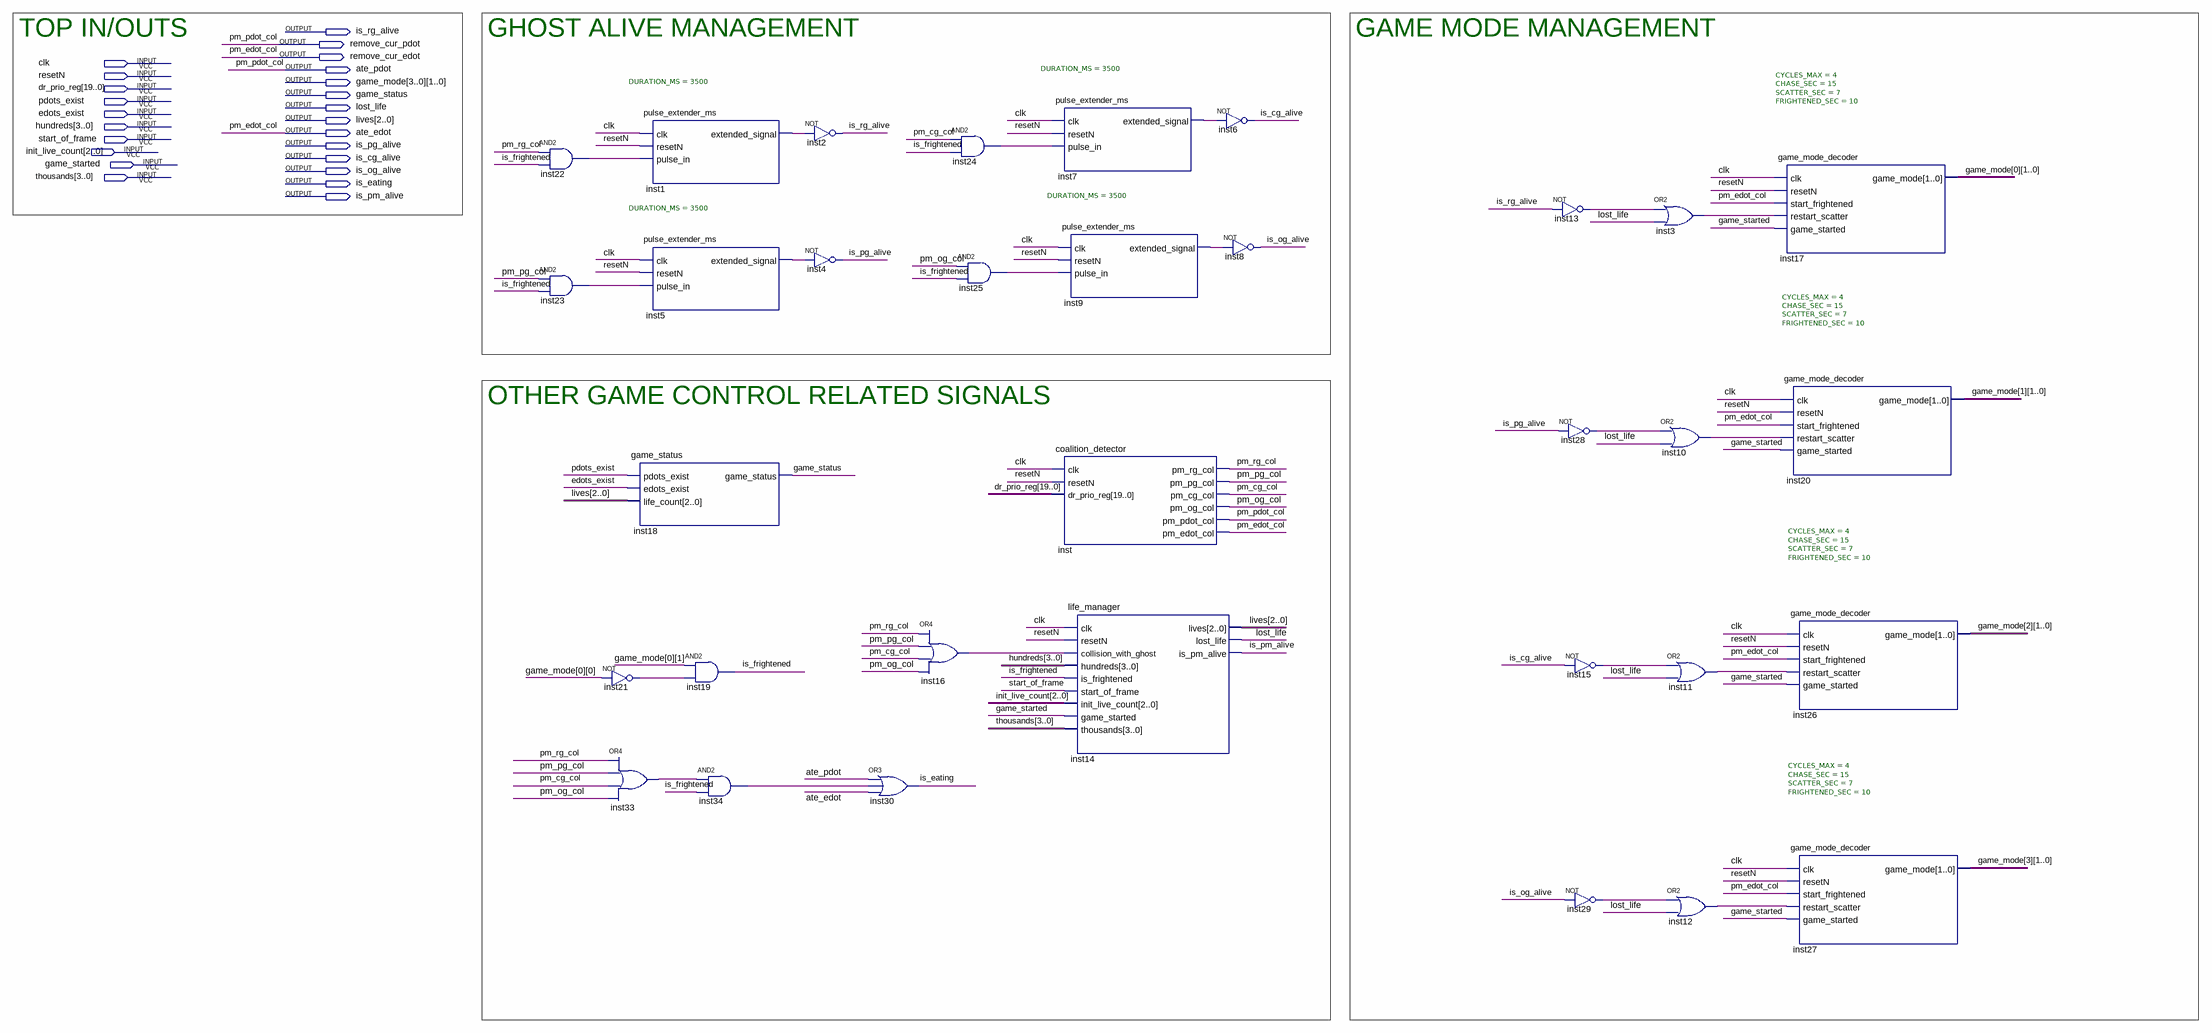
[diagram p0: schematic sheet]
// Quartus schematic TOP_GAME_CONTROL.bdf as structural Verilog: 33 symbols, 24 pins
module TOP_GAME_CONTROL (
  input  clk,
  input  resetN,
  input  [19:0] dr_prio_reg,
  input  pdots_exist,
  input  edots_exist,
  input  [3:0] hundreds,
  input  start_of_frame,
  input  [2:0] init_live_count,
  input  game_started,
  input  [3:0] thousands,
  output is_rg_alive,
  output remove_cur_pdot,
  output remove_cur_edot,
  output ate_pdot,
  output [1:0] game_mode_3,
  output [1:0] game_mode_2,
  output [1:0] game_mode_1,
  output [1:0] game_mode_0,
  output game_status,
  output lost_life,
  output [2:0] lives,
  output ate_edot,
  output is_pg_alive,
  output is_cg_alive,
  output is_og_alive,
  output is_eating,
  output is_pm_alive
);

  wire inst1_extended_signal, inst3_out, inst5_extended_signal, inst7_extended_signal, inst9_extended_signal,
       inst10_out, inst11_out, inst12_out, inst13_out, inst15_out, inst16_out, inst21_out, inst22_out,
       inst23_out, inst24_out, inst25_out, inst28_out, inst29_out, inst33_out, inst34_out, is_frightened,
       pm_cg_col, pm_og_col, pm_pg_col, pm_rg_col;

  and inst22 (inst22_out, pm_rg_col, is_frightened);
  and inst23 (inst23_out, pm_pg_col, is_frightened);
  not inst21 (inst21_out, game_mode_0[0]);
  or inst33 (inst33_out, pm_rg_col, pm_pg_col, pm_cg_col, pm_og_col);
  pulse_extender_ms #(.DURATION_MS(3500)) inst1 (
    .clk(clk), .resetN(resetN), .pulse_in(inst22_out), .extended_signal(inst1_extended_signal));
  pulse_extender_ms #(.DURATION_MS(3500)) inst5 (
    .clk(clk), .resetN(resetN), .pulse_in(inst23_out), .extended_signal(inst5_extended_signal));
  game_status inst18 (
    .pdots_exist(pdots_exist), .edots_exist(edots_exist), .life_count(lives), .game_status(game_status));
  and inst19 (is_frightened, game_mode_0[1], inst21_out);
  and inst34 (inst34_out, inst33_out, is_frightened);
  not inst2 (is_rg_alive, inst1_extended_signal);
  not inst4 (is_pg_alive, inst5_extended_signal);
  or inst30 (is_eating, ate_pdot, inst34_out, ate_edot);
  and inst24 (inst24_out, pm_cg_col, is_frightened);
  and inst25 (inst25_out, pm_og_col, is_frightened);
  or inst16 (inst16_out, pm_rg_col, pm_pg_col, pm_cg_col, pm_og_col);
  pulse_extender_ms #(.DURATION_MS(3500)) inst7 (
    .clk(clk), .resetN(resetN), .pulse_in(inst24_out), .extended_signal(inst7_extended_signal));
  pulse_extender_ms #(.DURATION_MS(3500)) inst9 (
    .clk(clk), .resetN(resetN), .pulse_in(inst25_out), .extended_signal(inst9_extended_signal));
  coalition_detector inst (
    .clk(clk), .resetN(resetN), .dr_prio_reg(dr_prio_reg), .pm_rg_col(pm_rg_col), .pm_pg_col(pm_pg_col),
    .pm_cg_col(pm_cg_col), .pm_og_col(pm_og_col), .pm_pdot_col(ate_pdot), .pm_edot_col(ate_edot));
  life_manager inst14 (
    .clk(clk), .resetN(resetN), .collision_with_ghost(inst16_out), .hundreds(hundreds),
    .is_frightened(is_frightened), .start_of_frame(start_of_frame), .init_live_count(init_live_count),
    .game_started(game_started), .thousands(thousands), .lives(lives), .lost_life(lost_life),
    .is_pm_alive(is_pm_alive));
  not inst6 (is_cg_alive, inst7_extended_signal);
  not inst8 (is_og_alive, inst9_extended_signal);
  not inst13 (inst13_out, is_rg_alive);
  not inst28 (inst28_out, is_pg_alive);
  not inst15 (inst15_out, is_cg_alive);
  not inst29 (inst29_out, is_og_alive);
  or inst3 (inst3_out, inst13_out, lost_life);
  or inst10 (inst10_out, inst28_out, lost_life);
  or inst11 (inst11_out, inst15_out, lost_life);
  or inst12 (inst12_out, inst29_out, lost_life);
  game_mode_decoder #(.CYCLES_MAX(4), .CHASE_SEC(15), .SCATTER_SEC(7), .FRIGHTENED_SEC(10)) inst17 (
    .clk(clk), .resetN(resetN), .start_frightened(ate_edot), .restart_scatter(inst3_out),
    .game_started(game_started), .game_mode(game_mode_0));
  game_mode_decoder #(.CYCLES_MAX(4), .CHASE_SEC(15), .SCATTER_SEC(7), .FRIGHTENED_SEC(10)) inst20 (
    .clk(clk), .resetN(resetN), .start_frightened(ate_edot), .restart_scatter(inst10_out),
    .game_started(game_started), .game_mode(game_mode_1));
  game_mode_decoder #(.CYCLES_MAX(4), .CHASE_SEC(15), .SCATTER_SEC(7), .FRIGHTENED_SEC(10)) inst26 (
    .clk(clk), .resetN(resetN), .start_frightened(ate_edot), .restart_scatter(inst11_out),
    .game_started(game_started), .game_mode(game_mode_2));
  game_mode_decoder #(.CYCLES_MAX(4), .CHASE_SEC(15), .SCATTER_SEC(7), .FRIGHTENED_SEC(10)) inst27 (
    .clk(clk), .resetN(resetN), .start_frightened(ate_edot), .restart_scatter(inst12_out),
    .game_started(game_started), .game_mode(game_mode_3));

  assign remove_cur_edot = ate_edot;
  assign remove_cur_pdot = ate_pdot;

  // Other names for the same wires on the sheet: pm_edot_col = ate_edot; pm_pdot_col = ate_pdot

  // Notes on the sheet:
  //   TOP IN/OUTS
  //   GHOST ALIVE MANAGEMENT
  //   GAME MODE MANAGEMENT
  //   OTHER GAME CONTROL RELATED SIGNALS
endmodule
